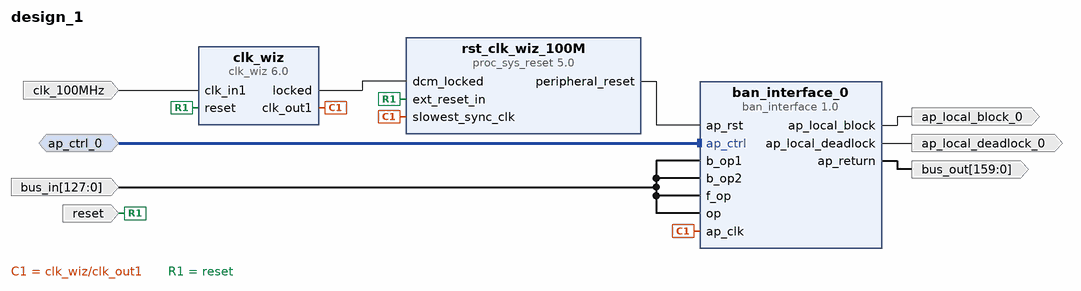
[diagram p0: block diagram of the top level]
# Vivado block design design_1, xczu7ev-ffvc1156-2-e, Vivado 2021.2
create_bd_design design_1

create_bd_intf_port -mode Slave -vlnv xilinx.com:interface:acc_handshake_rtl:1.0 ap_ctrl_0
create_bd_port -dir I -type clk clk_100MHz
set_property -dict {CONFIG.FREQ_HZ 100000000} [get_bd_ports clk_100MHz]
create_bd_port -dir I -type rst reset
set_property -dict {CONFIG.POLARITY ACTIVE_HIGH} [get_bd_ports reset]
create_bd_port -dir I -from 127 -to 0 -type data bus_in
create_bd_port -dir O ap_local_block_0
create_bd_port -dir O ap_local_deadlock_0
create_bd_port -dir O -from 159 -to 0 -type data bus_out

create_bd_cell -type ip -vlnv xilinx.com:hls:ban_interface:1.0 ban_interface_0
create_bd_cell -type ip -vlnv xilinx.com:ip:clk_wiz:6.0 clk_wiz
set_property -dict {CONFIG.RESET_BOARD_INTERFACE reset CONFIG.USE_BOARD_FLOW true} [get_bd_cells clk_wiz]
create_bd_cell -type ip -vlnv xilinx.com:ip:proc_sys_reset:5.0 rst_clk_wiz_100M
set_property -dict {CONFIG.RESET_BOARD_INTERFACE reset CONFIG.USE_BOARD_FLOW true} [get_bd_cells rst_clk_wiz_100M]

# ---- connections ----

connect_bd_intf_net -intf_net ap_ctrl_0_1 [get_bd_intf_ports ap_ctrl_0] [get_bd_intf_pins ban_interface_0/ap_ctrl]
connect_bd_net -net b_op1_0_1 [get_bd_ports bus_in] \
  [get_bd_pins ban_interface_0/b_op1] [get_bd_pins ban_interface_0/b_op2] [get_bd_pins ban_interface_0/f_op] \
  [get_bd_pins ban_interface_0/op]
connect_bd_net [get_bd_pins ban_interface_0/ap_local_block] [get_bd_ports ap_local_block_0]
connect_bd_net [get_bd_pins ban_interface_0/ap_local_deadlock] [get_bd_ports ap_local_deadlock_0]
connect_bd_net [get_bd_pins ban_interface_0/ap_return] [get_bd_ports bus_out]
connect_bd_net [get_bd_ports clk_100MHz] [get_bd_pins clk_wiz/clk_in1]
connect_bd_net [get_bd_pins clk_wiz/clk_out1] [get_bd_pins ban_interface_0/ap_clk] [get_bd_pins rst_clk_wiz_100M/slowest_sync_clk]
connect_bd_net [get_bd_pins clk_wiz/locked] [get_bd_pins rst_clk_wiz_100M/dcm_locked]
connect_bd_net [get_bd_ports reset] [get_bd_pins clk_wiz/reset] [get_bd_pins rst_clk_wiz_100M/ext_reset_in]
connect_bd_net [get_bd_pins rst_clk_wiz_100M/peripheral_reset] [get_bd_pins ban_interface_0/ap_rst]

validate_bd_design
save_bd_design
